# EasyEDA Pro project ProPrj_fidget keyboard_2026-06-28.epro

# Schematic Schematic1
Board Name: Board1; Create Date: 2026-06-21; Page Name: P1; Project Name: fidget keyboard; Schematic Name: Schematic1; Update Date: 2026-06-21; Company: EasyEDA.com; Page Size: A4; Version: V1.0
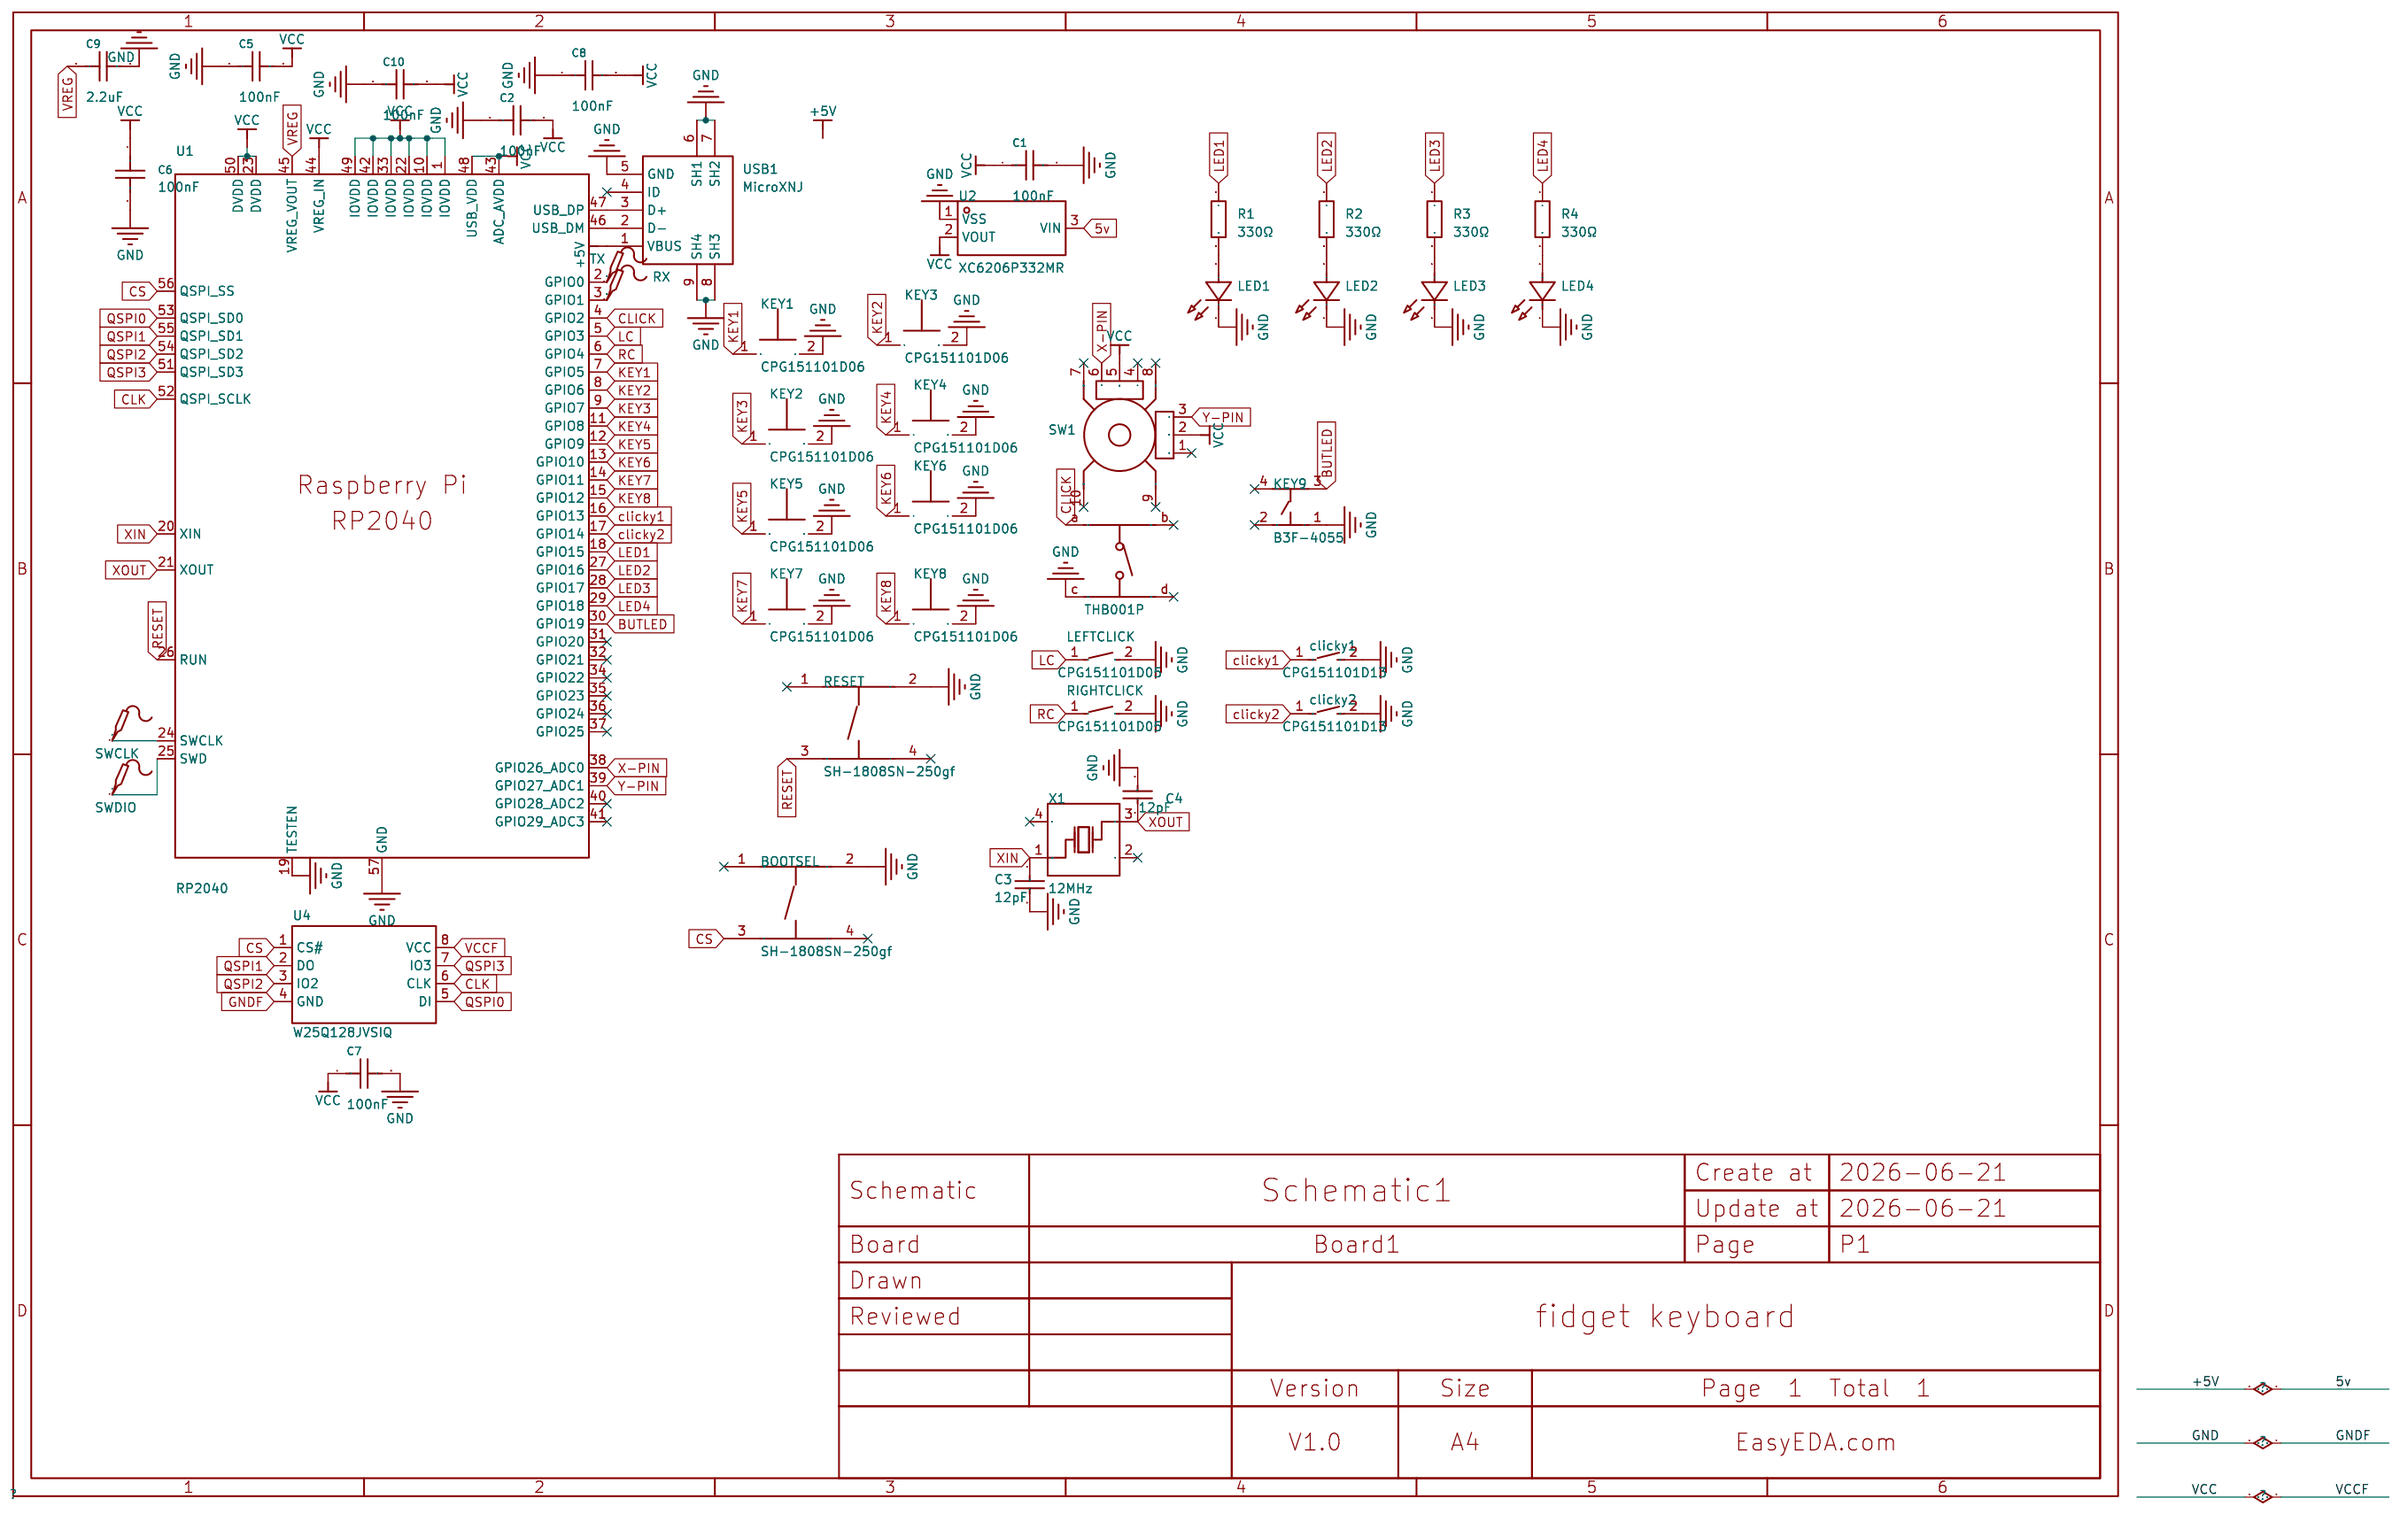
[diagram p0: schematic sheet]

## Parts
BOOTSEL  SH-1808SN-250gf  [SW-SMD_4P-L4.2-W3.4-P2.15-LS5.2]
C1  100nF  [C0402]
C2  100nF  [C0402]
C3  12pF  [C0603]
C4  12pF  [C0603]
C5  100nF  [C0402]
C6  100nF  [C0402]
C7  100nF  [C0402]
C8  100nF  [C0402]
C9  2.2uF  [C0603]
C10  100nF  [C0402]
clicky1  CPG151101D13  [KEY-TH_CPG151101D21X]
clicky2  CPG151101D13  [KEY-TH_CPG151101D21X]
KEY1  CPG151101D06  [KEY-TH_CPG151101D06]
KEY2  CPG151101D06  [KEY-TH_CPG151101D06]
KEY3  CPG151101D06  [KEY-TH_CPG151101D06]
KEY4  CPG151101D06  [KEY-TH_CPG151101D06]
KEY5  CPG151101D06  [KEY-TH_CPG151101D06]
KEY6  CPG151101D06  [KEY-TH_CPG151101D06]
KEY7  CPG151101D06  [KEY-TH_CPG151101D06]
KEY8  CPG151101D06  [KEY-TH_CPG151101D06]
KEY9  B3F-4055  [KEY-TH_4P-L12.0-W12.0-P5.00-LS13.4-EH]
LED1  XL-1608SURC-06  [LED0603-RD_RED]
LED2  XL-1608SURC-06  [LED0603-RD_RED]
LED3  XL-1608SURC-06  [LED0603-RD_RED]
LED4  XL-1608SURC-06  [LED0603-RD_RED]
LEFTCLICK  CPG151101D05  [SW-TH_CPG151101D05]
R1  330Ω  [R0603]
R2  330Ω  [R0603]
R3  330Ω  [R0603]
R4  330Ω  [R0603]
RESET  SH-1808SN-250gf  [SW-SMD_4P-L4.2-W3.4-P2.15-LS5.2]
RIGHTCLICK  CPG151101D05  [SW-TH_CPG151101D05]
RX  -  [Test-Point-0.5mm]
SW1  THB001P  [SW-TH_THB001P]
SWCLK  -  [Test-Point-0.5mm]
SWDIO  -  [Test-Point-0.5mm]
TX  -  [Test-Point-0.5mm]
U1  RP2040  [LQFN-56_L7.0-W7.0-P0.4-EP]
U2  XC6206P332MR  [SOT-23-3_L3.0-W1.7-P0.95-LS2.9-BR]
U4  W25Q128JVSIQ  [SOIC-8_L5.3-W5.3-P1.27-LS8.0-BL]
USB1  MicroXNJ  [MICRO-USB-SMD_MICROXNJ_1]
X1  12MHz  [OSC-SMD_4P-L3.2-W2.5-BL]

## Library data of the parts
BOOTSEL RESET = SH-1808SN-250gf: LCSC Part Name: TS3425PA 250gf编带; Supplier Part: C52092028; Manufacturer: SHOU HAN(首韩); Supplier Footprint: SMD; JLCPCB Part Class: Extended Part; Datasheet: https://item.szlcsc.com/datasheet/SH-1808SN-250gf/54864052.html; Supplier: LCSC
C1 C2 C5-C8 C10 = 0402B104K160CT_C83056: Capacitance: Tolerance:±10% Tolerance:±10% Voltage Rated: Temperature Coefficient:; LCSC Part Name: 100nF ±10% 16V; Supplier Part: C83056; Manufacturer: Walsin(华新科); Manufacturer Part: 0402B104K160CT; Supplier Footprint: 0402; JLCPCB Part Class: Extended Part; Datasheet: https://atta.szlcsc.com/upload/public/pdf/source/20161119/1479540178927.pdf; Supplier: LCSC; Tolerance: ±10%
C3 C4 = CC0603JRNPO9BN120: Capacitance:12pF Tolerance:±5% Tolerance:±5% Voltage Rating:50V Temperature Coefficient:NP0; LCSC Part Name: 12pF ±5% 50V; Supplier Part: C107034; Manufacturer: YAGEO(国巨); Supplier Footprint: 0603; JLCPCB Part Class: Extended Part; Datasheet: https://item.szlcsc.com/datasheet/CC0603JRNPO9BN120/108250.html; Supplier: LCSC; Tolerance: ±5%; Voltage Rating: 50V; Temperature Coefficient: NP0
C9 = GRM188R71A225KE15D: Capacitance: Tolerance:±10% Tolerance:±10% Voltage Rated: Temperature Coefficient:; LCSC Part Name: 2.2uF ±10% 10V; Supplier Part: C86018; Manufacturer: muRata(村田); Supplier Footprint: 0603; JLCPCB Part Class: Extended Part; Datasheet: https://atta.szlcsc.com/upload/public/pdf/source/20200305/C490387_23319AE8C154DEB24C505E6C82A8106A.pdf; Supplier: LCSC; Tolerance: ±10%
clicky1 clicky2 = CPG151101D13: Axis Type:Blue Switch Operation Force:50gf Conduction Travel:2.2mm Voltage Rating:12V Operating Temperature:-40℃~+70℃ Operating Temperature:-40℃~+70℃; LCSC Part Name: 青轴; Supplier Part: C49234235; Manufacturer: HanElectricity(瀚源); Supplier Footprint: 插件; JLCPCB Part Class: Extended Part; Datasheet: https://item.szlcsc.com/datasheet/CPG151101D13/51650377.html; Supplier: LCSC; Axis Type: Blue Switch; Operation Force: 50gf; Conduction Travel: 2.2mm; Voltage Rating: 12V; Operating Temperature: -40℃~+70℃
KEY1-KEY8 = CPG151101D06: Axis Type:Brown Switch Operation Force:45gf Conduction Travel:2mm Voltage Rating:12V Operating Temperature:-40℃~+70℃ Operating Temperature:-40℃~+70℃; LCSC Part Name: 茶轴; Supplier Part: C49234237; Manufacturer: HanElectricity(瀚源); Supplier Footprint: 插件; JLCPCB Part Class: Extended Part; Datasheet: https://item.szlcsc.com/datasheet/CPG151101D06/51650379.html; Supplier: LCSC; Axis Type: Brown Switch; Operation Force: 45gf; Conduction Travel: 2mm; Voltage Rating: 12V; Operating Temperature: -40℃~+70℃
KEY9 = B3F-4055_C84931: Circuit:SPST Actuator Style:Rectangular Button Mounting Type:Through Hole Length:12mm Width:12mm Switch Height:7.3mm Contact Current:50mA Voltage Rating:24V With Lamp:- Life:-; LCSC Part Name: 12*12*7.3mm 直插 轻触开关; Supplier Part: C84931; Manufacturer: OMRON(欧姆龙); Supplier Footprint: 插件-4P,12x12mm; JLCPCB Part Class: Extended Part; Datasheet: https://item.szlcsc.com/datasheet/B3F-4055/86103.html; Supplier: LCSC; Circuit: SPST; Actuator Style: Rectangular Button; Mounting Type: Through Hole; Length: 12mm; Width: 12mm; Switch Height: 7.3mm; Contact Current: 50mA; Voltage Rating: 24V
LED1-LED4 = XL-1608SURC-06: Lamp Holder Type:1.6mm x 0.8mm square LED Illumination Color:Red Voltage - Forward(Vf):2.3V Voltage - Forward(Vf):2.3V Power(Watts):50mW Forward Current:20mA Wavelength - Dominant:620nm~630nm Wavelength - Dominant:620nm~630nm Peak Wavelength:625nm Peak Wa; LCSC Part Name: 0603红色贴片式发光二极管; Supplier Part: C965799; Manufacturer: XINGLIGHT(成兴光); Supplier Footprint: 0603; JLCPCB Part Class: Extended Part; Datasheet: https://item.szlcsc.com/datasheet/XL-1608SURC-06/1051408.html; Supplier: LCSC; Lamp Holder Type: 1.6mm x 0.8mm square LED; Illumination Color: Red; Voltage - Forward(Vf): 2.3V; Power(Watts): 50mW; Forward Current: 20mA; Wavelength - Dominant: 620nm~630nm; Peak Wavelength: 625nm; Diode Configuration: Discrete Diode; Lens Color: Water Clear; Luminous Intensity: 225mcd; Viewing Angle: 120°; Mounting Style: Top-mount; Operating Temperature: -40℃~+85℃
LEFTCLICK RIGHTCLICK = CPG151101D05: Axis Type:Red Switch Operation Force:45gf Conduction Travel:2mm Voltage Rating:12V Operating Temperature:-40℃~+70℃ Operating Temperature:-40℃~+70℃; LCSC Part Name: 红轴; Supplier Part: C49234236; Manufacturer: HanElectricity(瀚源); Supplier Footprint: 插件; JLCPCB Part Class: Extended Part; Datasheet: https://item.szlcsc.com/datasheet/CPG151101D05/51650378.html; Supplier: LCSC; Axis Type: Red Switch; Operation Force: 45gf; Conduction Travel: 2mm; Voltage Rating: 12V; Operating Temperature: -40℃~+70℃
R1-R4 = RK73B1JTTD331J: Type:Thick Film Resistor Resistance:330Ω Tolerance:±5% Tolerance:±5% Power(Watts):125mW Voltage-Supply(Max):75V Temperature Coefficient:±200ppm/℃ Temperature Coefficient:±200ppm/℃ Operating Temperature:-55℃~+155℃ Operating Temperature:-55℃~+155℃; LCSC Part Name: 厚膜电阻 330Ω ±5% 125mW; Supplier Part: C131709; Manufacturer: KOA; Supplier Footprint: 0603; JLCPCB Part Class: Extended Part; Datasheet: https://item.szlcsc.com/datasheet/RK73B1JTTD331J/143005.html; Supplier: LCSC; Type: Thick Film Resistor; Tolerance: ±5%; Power(Watts): 125mW; Voltage-Supply(Max): 75V; Temperature Coefficient: ±200ppm/℃; Operating Temperature: -55℃~+155℃
RX SWCLK SWDIO TX = Test-Point: Test Point 测试点
SW1 = THB001P: Mounting Type:Straight Voltage Rating:12V Current Rating:50mA Mechanical Life:10,000 cycles Operating Temperature:-10℃~+70℃ Operating Temperature:-10℃~+70℃; LCSC Part Name: 微型指拨摇杆开关; Supplier Part: C2685355; Manufacturer: C&K; Supplier Footprint: 插件-14P,21x17mm; JLCPCB Part Class: Extended Part; Datasheet: https://item.szlcsc.com/datasheet/THB001P/2784876.html; Supplier: LCSC; Mounting Type: Straight; Voltage Rating: 12V; Current Rating: 50mA; Mechanical Life: 10,000 cycles; Operating Temperature: -10℃~+70℃
U1 = RP2040_C2040: CPU Core:- CPU Maximum Speed:133MHz Number of I/O:30 ADC (Bit):12bit; LCSC Part Name: RP2040（RP2B2）; Supplier Part: C2040; Manufacturer: Raspberry Pi(树莓派); Supplier Footprint: LQFN-56(7x7); JLCPCB Part Class: Extended Part; Datasheet: https://item.szlcsc.com/datasheet/RP2040/2392.html; Supplier: LCSC; CPU Maximum Speed: 133MHz; Number of I/O: 30; ADC (Bit): 12bit
U2 = XC6206P332MR_C347376: Output Configuration:Positive Voltage - Supply:8V Output Voltage:3.3V Output Voltage:3.3V Output Current:250mA Power Supply Rejection Ratio (PSRR):40dB@(1kHz) Voltage Dropout:240mV@(50mA) standby current:7uA Noise:- Features:Over Current Protection；Short; LCSC Part Name: 3.3V 250mA 8V; Supplier Part: C347376; Manufacturer: UMW(友台半导体); Supplier Footprint: SOT-23; JLCPCB Part Class: Extended Part; Datasheet: https://item.szlcsc.com/datasheet/XC6206P332MR/324036.html; Supplier: LCSC; Output Configuration: Positive; Voltage - Supply: 8V; Output Voltage: 3.3V; Output Current: 250mA; Power Supply Rejection Ratio (PSRR): 40dB@(1kHz); Voltage Dropout: 240mV@(50mA); standby current: 7uA; Features: Over Current Protection；Short Circuit Protection; Operating Temperature: -25℃~+80℃@(Ta); Output Type: Fixed; Number of Outputs: 1
U4 = W25Q128JVSIQ: Interface:SPI Memory Size:128Mbit Clock Frequency:133MHz Voltage - Supply:2.7V~3.6V Voltage - Supply:2.7V~3.6V Standby Supply Current:1uA Program / Erase Cycles:100,000 Cycles Page Programming Time (Tpp):3ms Block Erase Time(tBE):120ms@(32KB) Data Retenti; LCSC Part Name: 编带 支持双路/四路SPI接口的3V、128Mbit 串行闪存; Supplier Part: C97521; Manufacturer: Winbond(华邦); Supplier Footprint: SOIC-8-208mil; JLCPCB Part Class: Basic Part; Datasheet: https://item.szlcsc.com/datasheet/W25Q128JVSIQ/98729.html; Supplier: LCSC; Interface: SPI; Memory Size: 128Mbit; Clock Frequency: 133MHz; Voltage - Supply: 2.7V~3.6V; Standby Supply Current: 1uA; Program / Erase Cycles: 100,000 Cycles; Page Programming Time (Tpp): 3ms; Block Erase Time(tBE): 120ms@(32KB); Data Retention - TDR (Year): 20 Years; Operating Temperature: -40℃~+85℃
USB1 = MicroXNJ: Connector Type:Micro-B Protocol Standard:USB 2.0 Gender:Female Mounting Type:Surface Mount, Right Angle Number of Contacts:5P Number of Ports:1 Current Rating-Power:1.8A Voltage Rating:30V Connect-Disconnect Life:5,000 times Detection color:Black Operatin; LCSC Part Name: Micro小牛角卧贴母座; Supplier Part: C404969; Manufacturer: SHOU HAN(首韩); Supplier Footprint: SMD; JLCPCB Part Class: Extended Part; Datasheet: https://item.szlcsc.com/datasheet/MicroXNJ/392534.html; Supplier: LCSC; Connector Type: Micro-B; Protocol Standard: USB 2.0; Gender: Female; Mounting Type: Surface Mount, Right Angle; Number of Contacts: 5P; Number of Ports: 1; Current Rating-Power: 1.8A; Voltage Rating: 30V; Connect-Disconnect Life: 5,000 times; Detection color: Black; Operating Temperature: -20℃~+85℃
X1 = TXM12M0004322CBCDO00T: Type:Crystal Oscillator Frequency:12MHz Normal temperature Frequency Tolerance:±10ppm Normal temperature Frequency Tolerance:±10ppm Load Capacitance:9pF Frequency Stability:±20ppm Frequency Stability:±20ppm Equivalent Series Resistance(ESR):60Ω Operating; LCSC Part Name: 12MHz ±10ppm 9pF; Supplier Part: C362368; Manufacturer: YJX(雅晶鑫); Supplier Footprint: SMD3225-4P; JLCPCB Part Class: Extended Part; Datasheet: https://item.szlcsc.com/datasheet/TXM12M0004322CBCDO00T/337108.html; Supplier: LCSC; Type: Crystal Oscillator; Normal temperature Frequency Tolerance: ±10ppm; Load Capacitance: 9pF; Frequency Stability: ±20ppm; Equivalent Series Resistance(ESR): 60Ω; Operating Temperature: -40℃~+85℃

## Nets
+5V: U2.3(VIN) USB1.1(VBUS)
GND: BOOTSEL.2 C1.2 C2.1 C3.2 C4.2 C5.1 C6.2 C7.2 C8.1 C9.2 C10.1 clicky1.2 clicky2.2 KEY1.2 KEY2.2 KEY3.2 KEY4.2 KEY5.2 KEY6.2 KEY7.2 KEY8.2 KEY9.1 LED1.1(K) LED2.1(K) LED3.1(K) LED4.1(K) LEFTCLICK.2 RESET.2 RIGHTCLICK.2 SW1.c U1.19(TESTEN) U1.57(GND) U2.1(VSS) U4.4(GND) USB1.5(GND) USB1.6(SH1) USB1.7(SH2) USB1.8(SH3) USB1.9(SH4)
VCC: C1.1 C2.2 C5.2 C6.1 C7.1 C8.2 C10.2 SW1.2(DTA) SW1.5(DTA) U1.1(IOVDD) U1.10(IOVDD) U1.22(IOVDD) U1.23(DVDD) U1.33(IOVDD) U1.42(IOVDD) U1.43(ADC_AVDD) U1.44(VREG_IN) U1.48(USB_VDD) U1.49(IOVDD) U1.50(DVDD) U2.2(VOUT) U4.8(VCC)
BUTLED: KEY9.3 U1.30(GPIO19)
CLICK: SW1.a U1.4(GPIO2)
clicky1: clicky1.1 U1.16(GPIO13)
clicky2: clicky2.1 U1.17(GPIO14)
CLK: U1.52(QSPI_SCLK) U4.6(CLK)
CS: BOOTSEL.3 U1.56(QSPI_SS) U4.1(CS#)
KEY1: KEY1.1 U1.7(GPIO5)
KEY2: KEY3.1 U1.8(GPIO6)
KEY3: KEY2.1 U1.9(GPIO7)
KEY4: KEY4.1 U1.11(GPIO8)
KEY5: KEY5.1 U1.12(GPIO9)
KEY6: KEY6.1 U1.13(GPIO10)
KEY7: KEY7.1 U1.14(GPIO11)
KEY8: KEY8.1 U1.15(GPIO12)
LC: LEFTCLICK.1 U1.5(GPIO3)
LED1: R1.1 U1.18(GPIO15)
LED2: R2.1 U1.27(GPIO16)
LED3: R3.1 U1.28(GPIO17)
LED4: R4.1 U1.29(GPIO18)
QSPI0: U1.53(QSPI_SD0) U4.5(DI)
QSPI1: U1.55(QSPI_SD1) U4.2(DO)
QSPI2: U1.54(QSPI_SD2) U4.3(IO2)
QSPI3: U1.51(QSPI_SD3) U4.7(IO3)
RC: RIGHTCLICK.1 U1.6(GPIO4)
RESET: RESET.3 U1.26(RUN)
VREG: C9.1 U1.45(VREG_VOUT)
X-PIN: SW1.6(B) U1.38(GPIO26_ADC0)
XIN: C3.1 U1.20(XIN) X1.1(OSC1)
XOUT: C4.1 U1.21(XOUT) X1.3(OSC2)
Y-PIN: SW1.3(A) U1.39(GPIO27_ADC1)
$1N5: U1.47(USB_DP) USB1.3(D+)
$1N6: U1.46(USB_DM) USB1.2(D-)
$1N65: SWCLK.1 U1.24(SWCLK)
$1N66: SWDIO.1 U1.25(SWD)
$1N128: TX.1 U1.2(GPIO0)
$1N129: RX.1 U1.3(GPIO1)
$1N131: LED1.2(A) R1.2
$1N132: LED2.2(A) R2.2
$1N134: LED3.2(A) R3.2
$1N136: LED4.2(A) R4.2

Not connected (* = marked no-connect by the designer): BOOTSEL 1* 4*; KEY9 2* 4*; RESET 1* 4*; SW1 1(B)* 4(A)* 7(GND)* 8(GND)* 9(GND)* 10(GND)* b* d*; U1 31(GPIO20)* 32(GPIO21)* 34(GPIO22)* 35(GPIO23)* 36(GPIO24)* 37(GPIO25)* 40(GPIO28_ADC2)* 41(GPIO29_ADC3)*; USB1 4(ID)*; X1 2* 4*

# Board PCB1
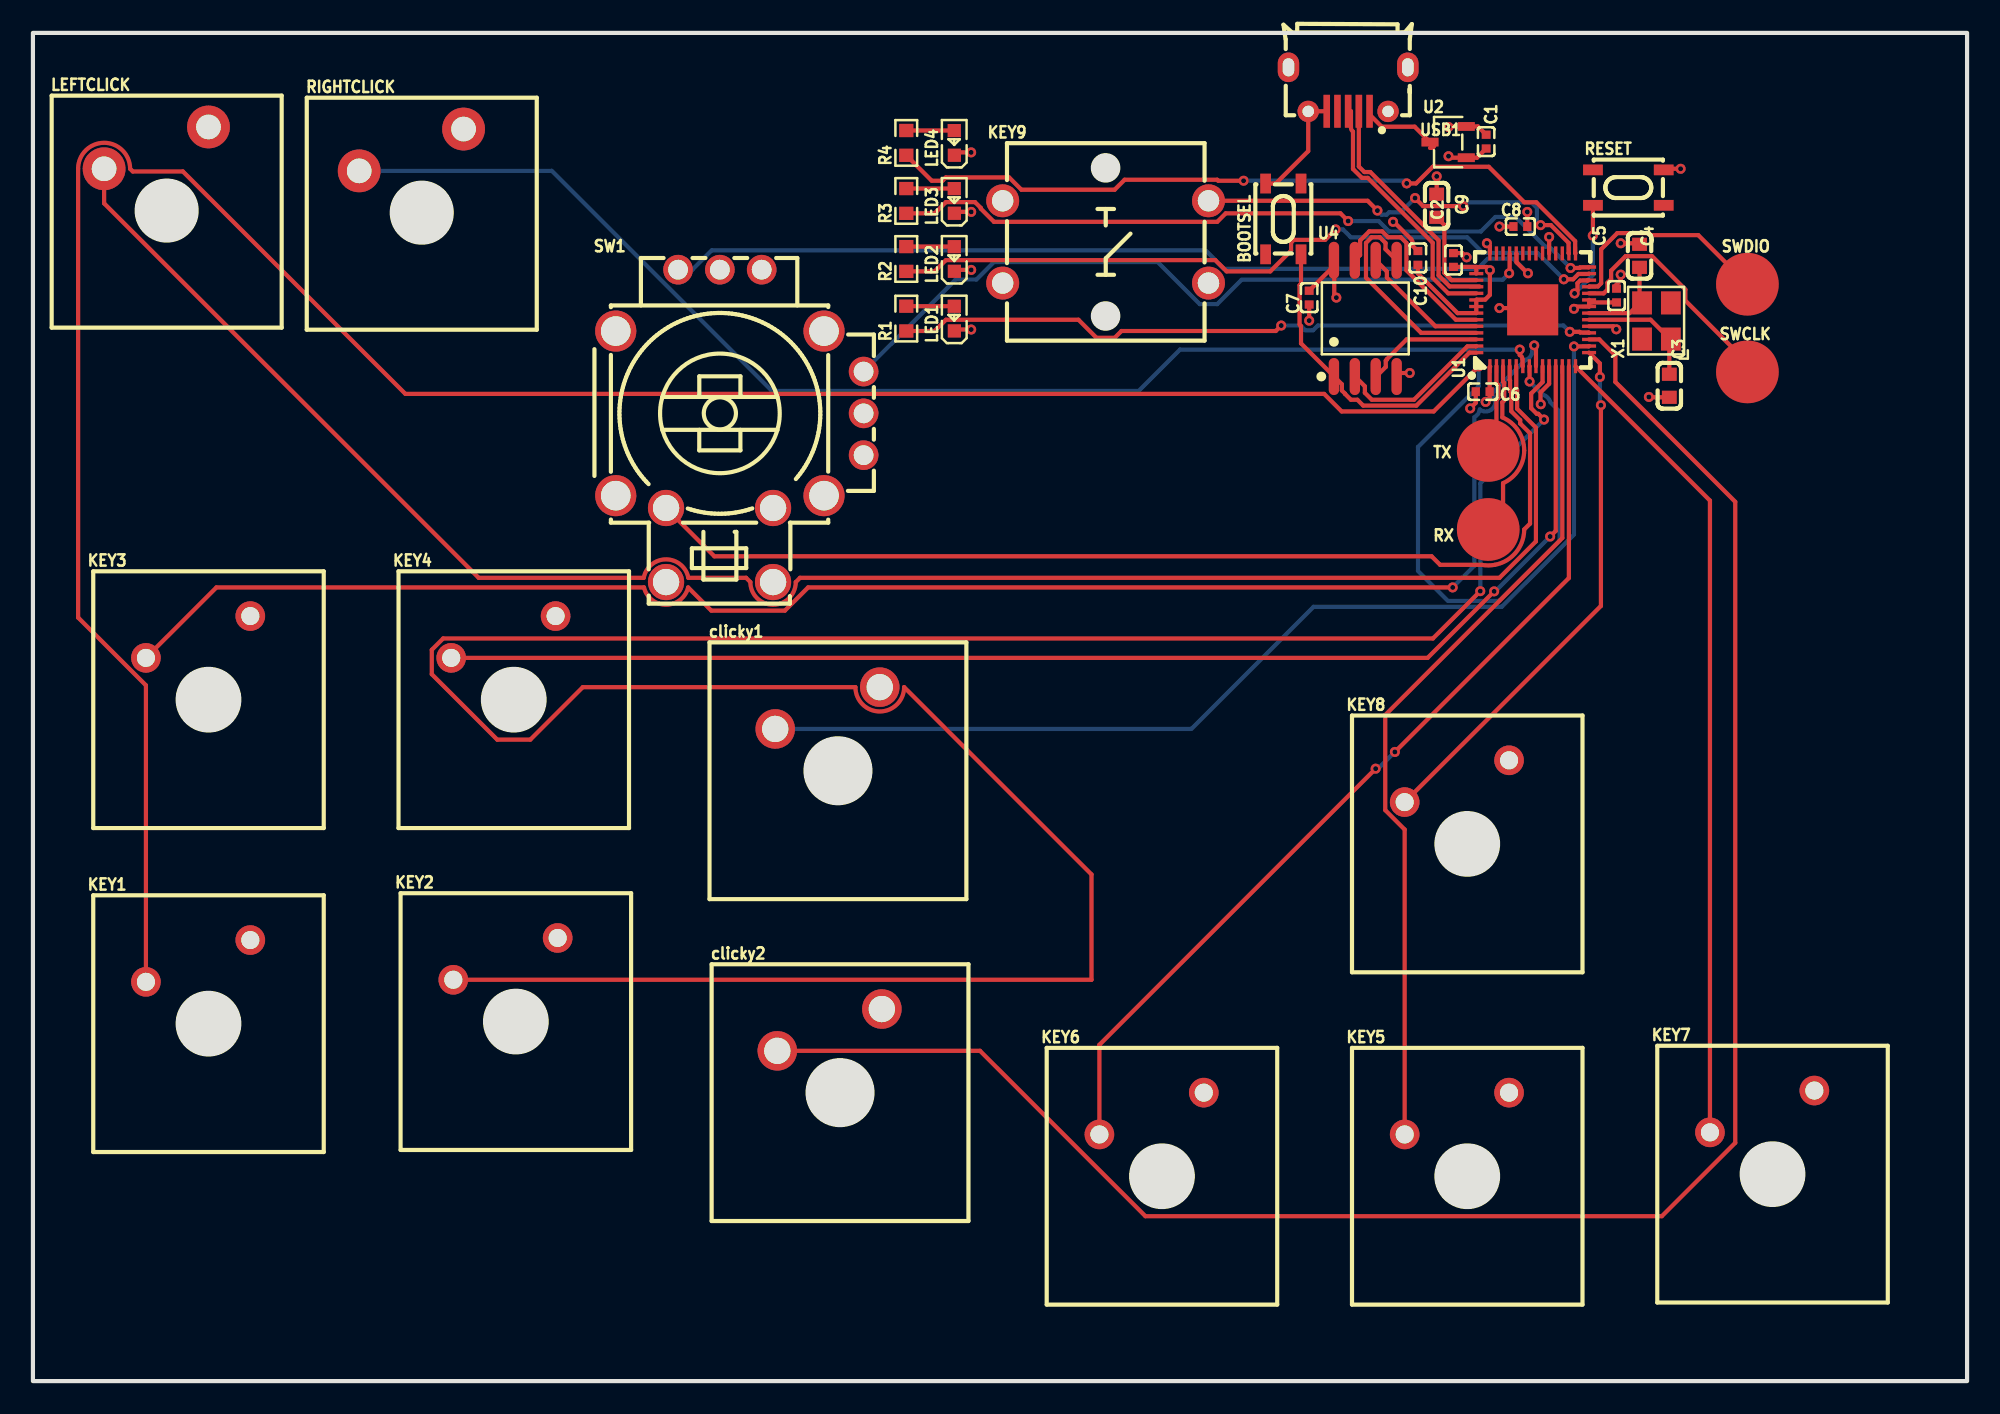
[diagram p1: board, top side]
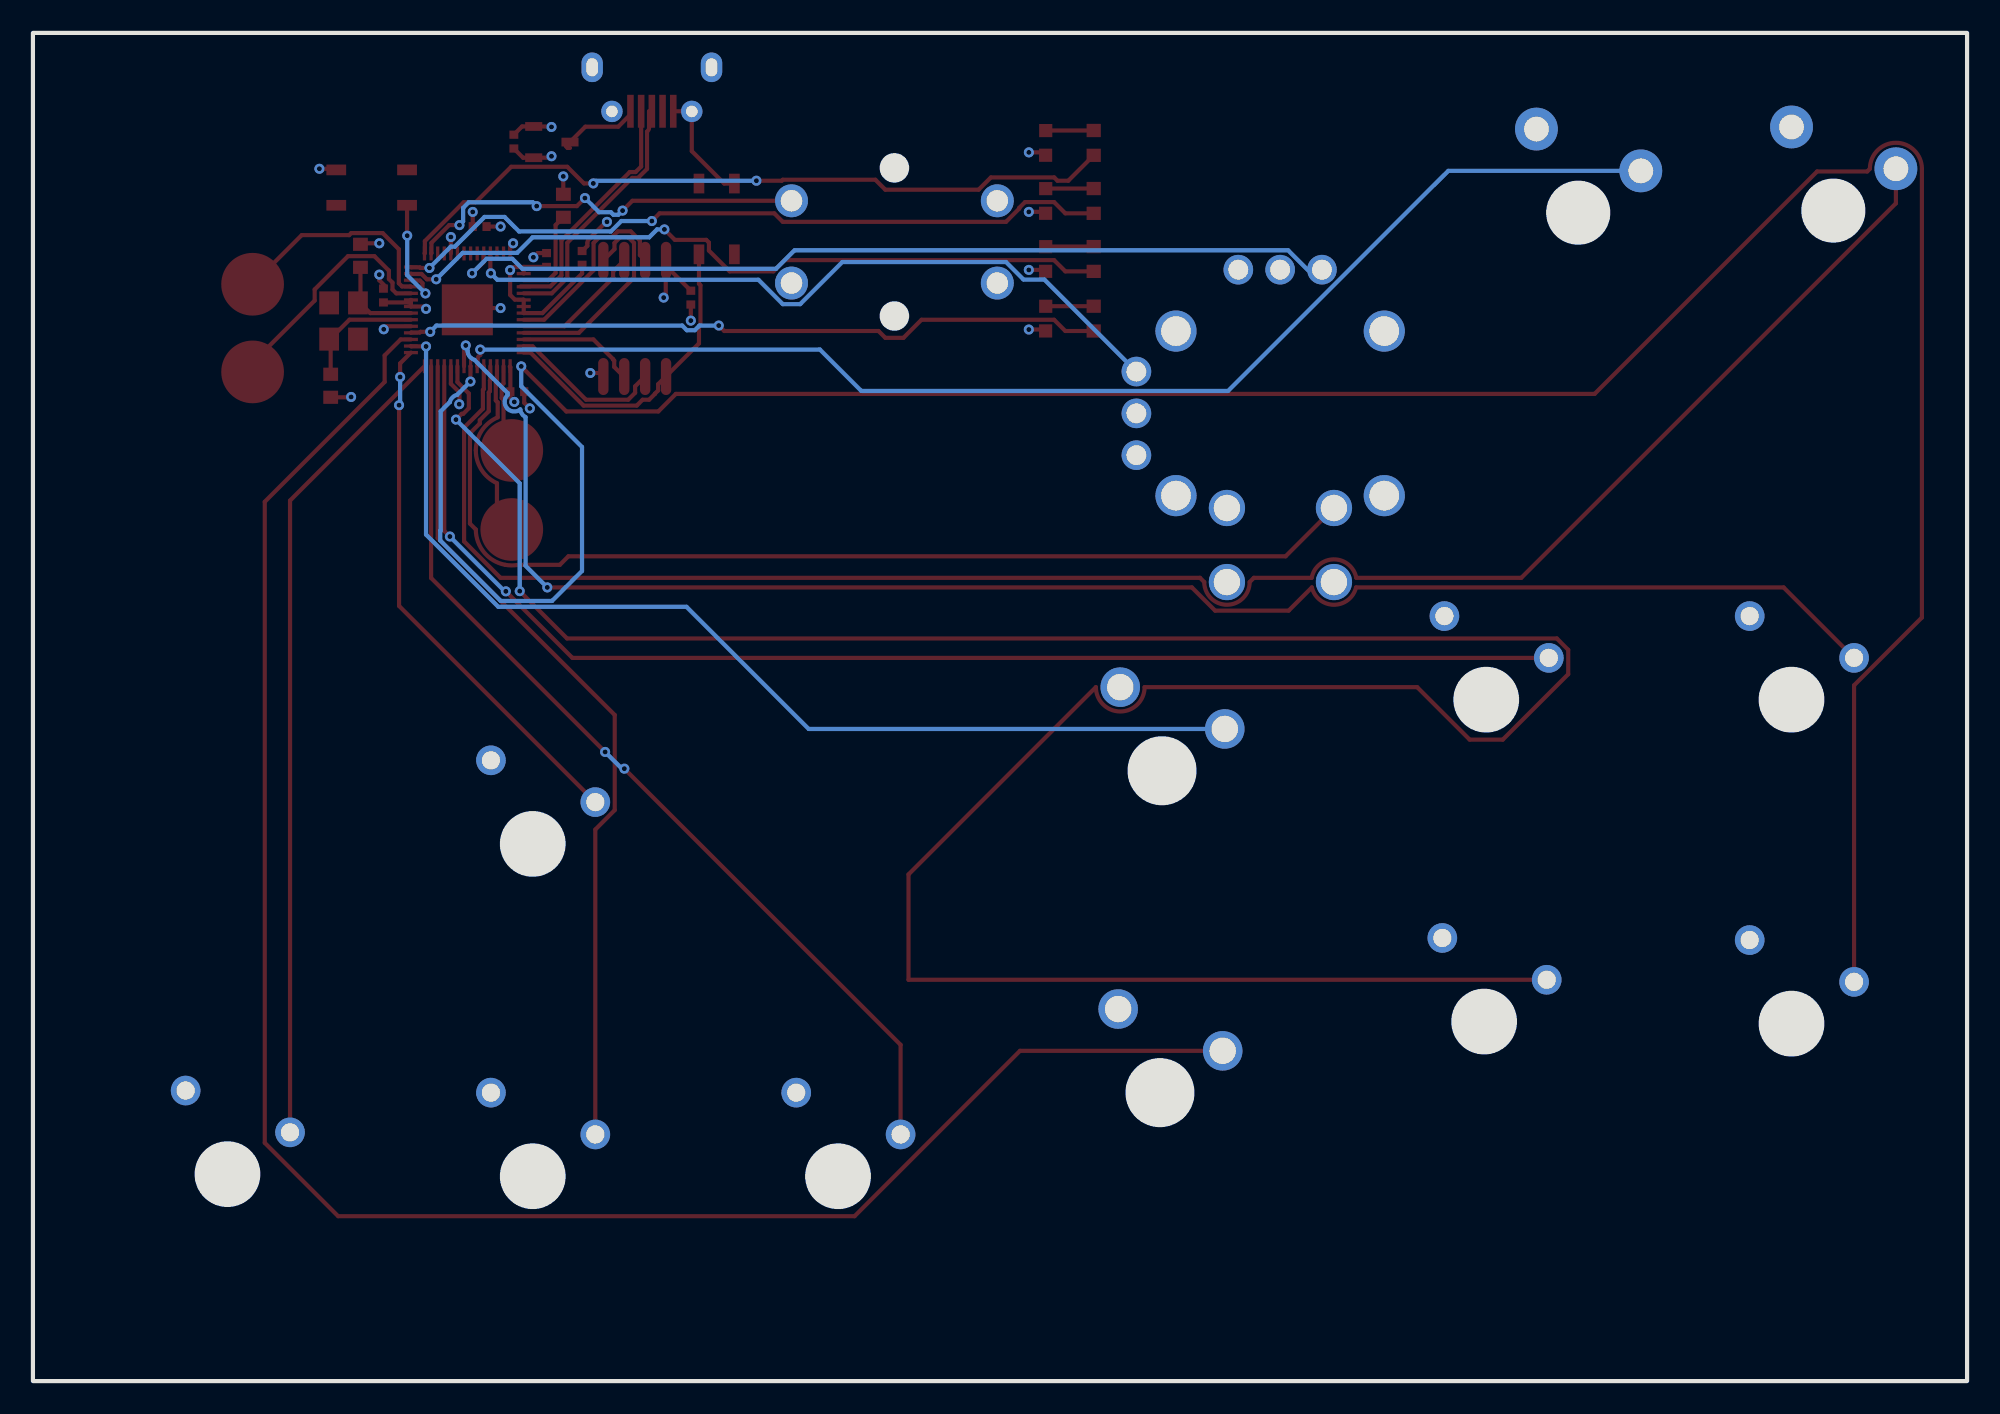
[diagram p2: board, bottom side, seen from below]

Outline 117.47 x 81.91 mm; copper layers: Top Layer, VCC, GND, Bottom Layer. Coordinates in mm from the lower left corner of the outline.
Outline path: rectangle 0,81.91 117.47,0
Stack: Top Layer 0.035mm / Dielectric1 1.51mm FR4 er 4.5 / VCC 0.035mm / GND 0.035mm / Bottom Layer 0.035mm

## Design rules (mm)
spacing copperThickness1oz (default): track to track 0.102, other pairs 0.152 to 0.3
spacing copperThickness2oz: track to track 0.203, other pairs 0.152 to 0.3
track width copperThickness1oz (default): min 0.127, default 0.254, max 2.54
track width copperThickness2oz: min 0.203, default 0.254, max 2.54
differential pair differentialPair (default): width min 0.127, default 0.254, max 2.54; gap min 0.152, default 0.152

## Placement (name value [footprint] x y rotation side)
BOOTSEL  SH-1808SN-250gf  [SW-SMD_4P-L4.2-W3.4-P2.15-LS5.2]  75.95 70.61 90 top
C1  100nF  [C0402]  88.26 75.31 270 top
C2  100nF  [C0402]  86.28 68.12 270 top
C3  12pF  [C0603]  99.39 60.48 270 top
C4  12pF  [C0603]  97.58 68.37 90 top
C5  100nF  [C0402]  96.18 65.96 270 top
C6  100nF  [C0402]  88.06 60.12 180 top
C7  100nF  [C0402]  77.52 65.83 270 top
C8  100nF  [C0402]  90.34 70.15 0 top
C9  2.2uF  [C0603]  85.26 71.41 90 top
C10  100nF  [C0402]  84.12 68.24 270 top
clicky1  CPG151101D13  [KEY-TH_CPG151101D21X]  48.26 40.89 0 top
clicky2  CPG151101D13  [KEY-TH_CPG151101D21X]  48.39 21.34 0 top
KEY1  CPG151101D06  [KEY-TH_CPG151101D06]  10.03 25.53 0 top
KEY2  CPG151101D06  [KEY-TH_CPG151101D06]  28.7 25.65 0 top
KEY3  CPG151101D06  [KEY-TH_CPG151101D06]  10.03 45.21 0 top
KEY4  CPG151101D06  [KEY-TH_CPG151101D06]  28.58 45.21 0 top
KEY5  CPG151101D06  [KEY-TH_CPG151101D06]  86.49 16.26 0 top
KEY6  CPG151101D06  [KEY-TH_CPG151101D06]  67.94 16.26 0 top
KEY7  CPG151101D06  [KEY-TH_CPG151101D06]  105.03 16.38 0 top
KEY8  CPG151101D06  [KEY-TH_CPG151101D06]  86.49 36.45 0 top
KEY9  B3F-4055  [KEY-TH_4P-L12.0-W12.0-P5.00-LS13.4-EH]  65.15 69.21 0 top
LED1  XL-1608SURC-06  [LED0603-RD_RED]  55.96 64.56 90 top
LED2  XL-1608SURC-06  [LED0603-RD_RED]  55.96 68.18 90 top
LED3  XL-1608SURC-06  [LED0603-RD_RED]  55.96 71.71 90 top
LED4  XL-1608SURC-06  [LED0603-RD_RED]  55.96 75.23 90 top
LEFTCLICK  CPG151101D05  [SW-TH_CPG151101D05]  7.49 74.93 0 top
R1  330Ω  [R0603]  53.05 64.56 90 top
R2  330Ω  [R0603]  53.05 68.18 90 top
R3  330Ω  [R0603]  53.05 71.71 90 top
R4  330Ω  [R0603]  53.05 75.23 90 top
RESET  SH-1808SN-250gf  [SW-SMD_4P-L4.2-W3.4-P2.15-LS5.2]  96.9 72.52 0 top
RIGHTCLICK  CPG151101D05  [SW-TH_CPG151101D05]  22.99 74.8 0 top
RX  -  [Test-Point-0.5mm]  88.39 51.74 0 top
SW1  THB001P  [SW-TH_THB001P]  42.93 58.04 0 top
SWCLK  -  [Test-Point-0.5mm]  104.13 61.32 0 top
SWDIO  -  [Test-Point-0.5mm]  104.13 66.64 0 top
TX  -  [Test-Point-0.5mm]  88.39 56.55 0 top
U1  RP2040  [LQFN-56_L7.0-W7.0-P0.4-EP]  91.09 65.09 90 top
U2  XC6206P332MR  [SOT-23-3_L3.0-W1.7-P0.95-LS2.9-BR]  85.96 75.28 0 top
U4  W25Q128JVSIQ  [SOIC-8_L5.3-W5.3-P1.27-LS8.0-BL]  80.92 64.57 0 top
USB1  MicroXNJ  [MICRO-USB-SMD_MICROXNJ_1]  79.88 78.49 180 top
X1  12MHz  [OSC-SMD_4P-L3.2-W2.5-BL]  98.61 64.41 90 top

## Footprints (pads in the part's own frame, mm; a bottom-side part is the same pattern mirrored in y, then rotated)
C0402
  rect 0.5x0.54 smd: 1(-0.42,0) 2(0.42,0)
C0603
  rect 0.8x0.9 smd: 1(-0.7,0) 2(0.7,0)
KEY-TH_4P-L12.0-W12.0-P5.00-LS13.4-EH
  round 2 hole 1.3: 1(6.25,-2.5) 2(-6.25,-2.5) 3(6.25,2.5) 4(-6.25,2.5)
KEY-TH_CPG151101D06
  round 1.8 hole 1.1: 1(-3.17,-1.27) 2(3.17,1.27)
KEY-TH_CPG151101D21X
  round 2.4 hole 1.6: 1(-3.175,-1.27) 2(3.175,1.27)
LED0603-RD_RED
  rect 0.8x0.8 smd: 1(-0.749,-0.004) 2(0.749,0.004)
LQFN-56_L7.0-W7.0-P0.4-EP
  rect 0.85x0.2 smd: 1(-3.425,2.6) 2(-3.425,2.2) 3(-3.425,1.8) 4(-3.425,1.4) 5(-3.425,1) 6(-3.425,0.6) 7(-3.425,0.2) 8(-3.425,-0.2) 9(-3.425,-0.6) 10(-3.425,-1) 11(-3.425,-1.4) 12(-3.425,-1.8) 13(-3.425,-2.2) 14(-3.425,-2.6) 29(3.425,-2.6) 30(3.425,-2.2) 31(3.425,-1.8) 32(3.425,-1.4) 33(3.425,-1) 34(3.425,-0.6) 35(3.425,-0.2) 36(3.425,0.2) 37(3.425,0.6) 38(3.425,1) 39(3.425,1.4) 40(3.425,1.8) 41(3.425,2.2) 42(3.425,2.6)
  rect 0.2x0.85 smd: 15(-2.6,-3.425) 16(-2.2,-3.425) 17(-1.8,-3.425) 18(-1.4,-3.425) 19(-1,-3.425) 20(-0.6,-3.425) 21(-0.2,-3.425) 22(0.2,-3.425) 23(0.6,-3.425) 24(1,-3.425) 25(1.4,-3.425) 26(1.8,-3.425) 27(2.2,-3.425) 28(2.6,-3.425) 43(2.6,3.425) 44(2.2,3.425) 45(1.8,3.425) 46(1.4,3.425) 47(1,3.425) 48(0.6,3.425) 49(0.2,3.425) 50(-0.2,3.425) 51(-0.6,3.425) 52(-1,3.425) 53(-1.4,3.425) 54(-1.8,3.425) 55(-2.2,3.425) 56(-2.6,3.425)
  rect 3.1x3.1 smd: 57(0,0)
MICRO-USB-SMD_MICROXNJ_1
  rect 0.4x2 smd: 1(-1.3,1.332) 2(-0.65,1.332) 3(0,1.332) 4(0.65,1.332) 5(1.3,1.332)
  round 1.3 hole 0.7: 6(2.425,1.34) 9(-2.425,1.34)
  oval 1.3x1.8 hole 0.7x1.1: 7(3.625,-1.34) 8(-3.625,-1.34)
OSC-SMD_4P-L3.2-W2.5-BL
  rect 1.4x1.2 smd: 1(-1.1,-0.875) 2(1.1,-0.875) 3(1.1,0.875) 4(-1.1,0.875)
R0603
  rect 0.806x0.864 smd: 1(-0.753,0) 2(0.753,0)
SOIC-8_L5.3-W5.3-P1.27-LS8.0-BL
  oval 0.63x2.25 smd: 1(-1.905,-3.53) 2(-0.635,-3.53) 3(0.635,-3.53) 4(1.905,-3.53) 5(1.905,3.53) 6(0.635,3.53) 7(-0.635,3.53) 8(-1.905,3.53)
SOT-23-3_L3.0-W1.7-P0.95-LS2.9-BR
  rect 1.038x0.532 smd: 1(1.101,-0.95) 2(1.101,0.95) 3(-1.101,0)
SW-SMD_4P-L4.2-W3.4-P2.15-LS5.2
  rect 1.2x0.65 smd: 1(-2.15,1.075) 2(2.15,1.075) 3(-2.15,-1.075) 4(2.15,-1.075)
SW-TH_CPG151101D05
  round 2.6 hole 1.5: 1(-3.17,-1.27) 2(3.17,1.27)
SW-TH_THB001P
  round 1.8 hole 1.2: 1(7.527,-1.78) 2(7.527,0.76) 3(7.527,3.3) 4(1.337,9.49) 5(-1.202,9.49) 6(-3.743,9.49)
  round 2.5 hole 1.8: 7(-7.527,5.76) 8(-7.527,-4.24) 9(5.122,-4.24) 10(5.122,5.76)
  round 2.2 hole 1.6: a(-4.472,-4.99) b(2.028,-4.99) c(-4.472,-9.49) d(2.028,-9.49)
Test-Point-0.5mm
  round 3.81 smd: 1(0,0)

## Nets
As in the schematic.

Pads without a net: BOOTSEL 1 4; KEY9 2 4; RESET 1 4; SW1 1 4 7 8 9 10 b d; U1 31 32 34 35 36 37 40 41; USB1 4; X1 2 4

## Via types
v1: diameter 0.61, hole 0.305, Top Layer to Bottom Layer, 57 vias

## Routing (per net, layer and track width the routed paths; a pad name or vN(x,y) marks a point on that pad's centre or on a via; arc(x,y) is an arc through that point)
+5V: length 4.9
  Top Layer w0.254: USB1.1 81.18,76.96 81.92,76.22 83.92,76.22 U2.3 ; 85.11,75.03 85,74.93 84.86,74.93
GND: length 28.8
  Top Layer w0.254: C1.2 87.71,74.33 86.05,74.33 85.96,74.42 ; C3.2 98.17,59.78 v1(98.15,59.8) ; 56.25,71.04 56.98,71.04 v1(56.99,71.04) ; v1(87.29,59.1) 87.64,59.44 C6.2 ; v1(87.08,68.28) 86.82,68.54 C2.1 ; v1(89.07,70.15) C8.1 ; v1(96.44,67.23) 96.44,66.89 96.06,66.51 ; 56.25,74.66 56.98,74.66 v1(56.98,74.66) ; BOOTSEL.2 75.49,72.76 77.46,74.73 USB1.6 77.47,77.15 USB1.5 ; v1(83.62,61.25) 83.07,61.25 82.85,61.03 ; v1(100.08,73.66) 99.12,73.66 RESET.2 ; U1.57 90.99,65.2 v1(89.07,65.2) ; v1(96.44,69.13) 97.52,69.13 C4.2 ; v1(96.17,63.91) 95.99,64.09 U1.19 ; 85.26,72.19 85.26,72.19 v1(85.26,73.2) ; C7.2 v1(77.52,64.43) ; v1(56.99,63.89) 56.98,63.89 56.25,63.89 ; v1(56.99,67.51) 56.98,67.52 56.25,67.52 ; v1(82.61,70.44) 82.66,70.44 83.69,69.4 arc(83.77,69.28) 83.8,69.15 83.8,68.97 84.12,68.66
  vias: v1(85.98,74.42)
VCC: length 28.5
  Top Layer w0.254: C2.2 87.66,67.7 U1.43 ; 84.12,67.82 84.12,67.3 86.53,64.89 U1.50 U1.49 U1.48 87.69,65.71 88.21,65.71 88.49,66 v1(88.49,67.5) 88.3,67.69 U1.43 ; U1.43 U1.44 ; U1.33 v1(92.09,69.51) ; 79.04,67.78 C7.1 ; 79.04,67.78 79.04,65.96 v1(79.17,65.83) ; 79.04,67.78 79.04,68.09 ; v1(93.6,65.15) 93.74,65.29 U1.22 U1.23 94.67,65.54 C5.2 ; 88.51,61.64 88.48,61.6 C6.1 88.48,59.74 v1(88.24,59.5) ; v1(88.31,69.13) 88.49,68.95 U1.42 ; U1.10 92.09,60.59 91.57,60.07 91.57,59.37 v1(91.58,59.35) ; C1.1 87.76,76.23 U2.2 87.06,76.23 85.95,76.23 ; C8.2 v1(90.76,71.04)
  vias: v1(85.98,76.2)
BUTLED: length 25.1
  Top Layer w0.254: v1(83.95,71.88) 84.44,71.39 v1(86.88,71.39) ; U1.30 93.27,68.54 93.27,69.16 92.19,70.24 v1(91.57,70.24) ; KEY9.3 81.07,71.71 v1(81.66,71.12)
  Bottom Layer w0.254: 86.87,71.37 87.12,71.62 91,71.62 91.35,71.28 91.35,70.46 v1(91.57,70.24) ; v1(81.66,71.12) 81.91,70.87 82.22,70.87 82.37,71.02 83.08,71.02 v1(83.95,71.88)
CLICK: length 65.4
  Top Layer w0.254: SW1.a 41.39,50.11 84.95,50.11 85.47,49.6 87.99,49.6 arc(88.39,49.56) 88.79,49.6 arc(90.07,50.35) 90.58,51.74 90.93,52.1 90.93,57.59 90.33,58.18 90.33,58.38 89.79,58.93 89.79,60.07 89.72,60.14 89.72,60.8 89.69,60.82 U1.4
CLICKY1:
  vias: v1(93.6,62.86)
clicky1: length 65.8
  Top Layer w0.254: U1.16 94.5,62.87 93.6,62.87 93.6,62.86
  Bottom Layer w0.254: clicky1.1 70.36,39.62 77.78,47.04 89.21,47.04 93.6,51.43 93.6,62.86
CLICKY2: length 116.5
  Top Layer w0.254: 94.52,63.29 95.14,63.29 96.11,62.32 96.11,60.71 103.39,53.43 103.39,14.48 98.94,10.02 67.57,10.02 57.52,20.07 45.72,20.07
CLK: length 8
  Top Layer w0.254: U4.6 82.24,67.42 82.24,67.04 85.19,64.09 U1.52
CS: length 19.3
  Top Layer w0.254: U1.56 87.25,62.49 84.03,59.27 80.8,59.27 80.44,59.63 80.05,59.63 79.7,59.98 79.7,59.99 79.5,60.19 79.5,60.57 77.02,63.05 77.02,64.1 76.93,64.19 76.93,66.58 77.02,66.67 BOOTSEL.3
KEY1: length 181.5
  Top Layer w0.254: v1(90.9,60.73) 90.9,61.66 U1.7 ; v1(87.82,61.65) 85.08,58.91 79.49,58.91 78.43,59.98 22.62,59.98 9.11,73.5 6.06,73.5 5.9,73.66 arc(4.32,75.24) 2.74,73.66 2.74,46.39 6.86,42.27 KEY1.1
  Bottom Layer w0.254: v1(90.9,60.73) 91.71,59.92 arc(92,59.77) 92.15,59.48 92.71,58.93 92.71,51.69 92.73,51.66 92.73,51.07 89.06,47.4 85.95,47.4 84.12,49.22 84.12,56.76 87.82,60.45 v1(87.82,61.65)
KEY2: length 101.9
  Top Layer w0.254: KEY3.1 11.14,48.22 37.11,48.22 arc(38.45,47.17) 39.79,48.22 41.2,46.81 45.67,46.81 47.08,48.22 v1(86.23,48.22) ; v1(91.18,62.93) 91.29,62.82 U1.8
  Bottom Layer w0.254: 87.55,58.53 87.55,49.54 v1(86.23,48.22) ; v1(91.18,62.93) 91.07,62.82 91.07,62.6 arc(91.07,62.52) 91.05,62.44 arc(90.9,62.2) 90.66,62.05 88.64,60.04 88.64,59.91 arc(88.68,59.11) 87.88,59.04 arc(87.77,58.77) 87.55,58.58
KEY3: length 177.2
  Top Layer w0.254: v1(87.91,48) 85.03,45.12 24.92,45.12 24.23,44.43 24.23,42.95 28.2,38.97 30.21,38.97 33.4,42.16 49.96,42.16 arc(51.44,40.68) 52.91,42.16 64.29,30.78 64.29,24.38 25.53,24.38 ; U1.9 91.69,60.7 91,60.01 91,59.11 91.34,58.77 91.43,58.77 v1(91.78,58.42)
  Bottom Layer w0.254: v1(91.78,58.42) 87.91,54.55 v1(87.91,48)
KEY4: length 80.3
  Top Layer w0.254: v1(92.15,51.32) 92.49,51.66 U1.11 ; KEY4.1 84.71,43.94 v1(88.75,47.98)
  Bottom Layer w0.254: v1(88.75,47.98) 88.82,47.98 v1(92.15,51.32)
KEY5: length 51.6
  Top Layer w0.254: U1.12 92.89,51.23 82.14,40.47 82.14,34.69 83.32,33.51 KEY5.1
KEY6: length 58.6
  Top Layer w0.254: v1(81.55,37.21) 64.78,20.43 KEY6.1 ; U1.13 93.29,48.8 v1(82.72,38.23)
  Bottom Layer w0.254: v1(81.55,37.21) 81.71,37.21 v1(82.72,38.23)
KEY7: length 49.9
  Top Layer w0.254: KEY7.1 101.86,53.5 U1.14
KEY8: length 32.5
  Top Layer w0.254: v1(95.17,61.01) 95.17,61.83 U1.15 ; KEY8.1 95.24,47.1 v1(95.24,59.29)
  Bottom Layer w0.254: v1(95.17,61.01) 95.17,59.36 v1(95.24,59.3)
LC: length 113.4
  Top Layer w0.254: LEFTCLICK.1 4.32,71.56 27.08,48.81 37.1,48.81 arc(38.45,49.93) 39.81,48.81 43.32,48.81 43.57,48.55 arc(44.95,47.17) 46.33,48.55 46.59,48.81 89.07,48.81 91.29,51.02 91.29,57.93 90.15,59.08 90.15,60.22 90.09,60.27 U1.5
LED1: length 42.9
  Top Layer w0.254: U1.18 94.5,63.71 93.98,63.71 93.93,63.75 v1(93.34,63.75) ; R1.1 54.77,63.8 55.45,64.49 63.5,64.49 64.6,63.39 65.7,63.39 66.12,63.8 75.49,63.8 v1(75.82,64.13)
  Bottom Layer w0.254: v1(93.34,63.75) 92.96,64.13 78.04,64.13 77.76,63.85 77.27,63.85 76.99,64.13 v1(75.82,64.13)
LED2: length 44.8
  Top Layer w0.254: v1(79.12,69.98) 78.49,69.34 76.58,69.34 76.42,69.18 76.42,68.69 75.16,67.43 72.5,67.43 71.81,68.11 55.45,68.11 54.77,67.43 R2.1 ; U1.27 94.5,67.27 93.87,67.27 93.55,66.94 v1(92.98,66.94)
  Bottom Layer w0.254: v1(92.98,66.94) 91.38,68.55 88.07,68.55 87.12,69.5 80.05,69.5 79.56,69.98 v1(79.12,69.98)
LED3: length 44.6
  Top Layer w0.254: v1(79.88,70.48) 79.42,70.95 72.45,70.95 71.93,70.44 58.37,70.44 57.57,71.24 57.57,71.28 57.22,71.64 55.45,71.64 54.77,70.95 53.05,70.95 ; U1.28 94.5,67.67 93.98,67.67 93.94,67.63 v1(93.39,67.63)
  Bottom Layer w0.254: v1(93.39,67.63) 92.09,68.93 91.85,68.93 90.05,70.73 88.83,70.73 87.95,69.85 82.37,69.85 81.74,70.48 v1(79.88,70.48)
LED4: length 45
  Top Layer w0.254: v1(83.44,72.77) 84.01,72.77 85.02,73.78 88.43,73.78 90.58,71.62 91.31,71.62 93.67,69.26 93.67,68.54 U1.29 ; v1(73.53,72.93) 71.99,72.93 71.93,72.99 66.31,72.99 65.7,72.39 60.04,72.39 59.29,73.13 55.44,73.13 55.25,72.93 54.59,72.93 R4.1
  Bottom Layer w0.254: v1(83.44,72.77) 83.28,72.93 v1(73.53,72.93)
QSPI0: length 13
  Top Layer w0.254: U1.53 84.32,63.69 80.97,67.04 80.97,69.15 81.31,69.5 81.81,69.5 82.15,69.15 82.15,68.77 U4.5
QSPI1: length 9.5
  Top Layer w0.254: U1.55 87.65,62.87 87.13,62.87 83.88,59.63 81.32,59.63 80.9,60.05 80.9,60.44 80.31,61.03
QSPI2: length 7.3
  Top Layer w0.254: U1.54 83.43,63.29 82.24,62.09 82.24,62.07 82.17,62 82.17,61.62 81.58,61.03
QSPI3: length 11.8
  Top Layer w0.254: U1.51 86.42,64.49 83.42,67.49 83.42,69.15 83.08,69.5 82.31,69.5 81.95,69.86 81.17,69.86 80.61,69.3 80.61,68.42 U4.7
RC: length 78.2
  Top Layer w0.254: v1(90.31,62.67) 90.31,62.35 arc(90.43,62.24) 90.47,62.09 90.47,61.69 U1.6
  Bottom Layer w0.254: v1(90.31,62.67) 69.67,62.67 67.16,60.16 44.88,60.16 31.51,73.53 RIGHTCLICK.1
RESET: length 7.3
  Top Layer w0.254: v1(93.63,66.09) 93.81,66.26 93.81,66.71 93.98,66.87 94.42,66.87 94.44,66.89 U1.26 ; v1(94.74,69.6) 94.75,69.6 RESET.3
  Bottom Layer w0.254: v1(94.74,69.6) 94.74,67.19 v1(93.63,66.09)
VREG: length 5.7
  Top Layer w0.254: C9.1 85.73,70.24 85.73,67.33 86.17,66.89 U1.45
X-PIN: length 54.7
  Top Layer w0.254: U1.38 90.11,68.49 90.11,67.97 90.78,67.31 v1(90.81,67.31)
  Bottom Layer w0.254: v1(90.81,67.31) 89.92,68.19 88.36,68.19 87.75,67.58 72.34,67.58 71.22,68.71 41.24,68.71 40.06,67.53 SW1.6
XIN: length 7.6
  Top Layer w0.254: 99.39,61.18 99.39,63.28 ; U1.20 98.25,64.49 99.43,63.31 X1.1
XOUT: length 5.3
  Top Layer w0.254: 97.58,67.42 97.58,65.54 97.61,65.51 96.99,64.89 U1.21
Y-PIN: length 45
  Top Layer w0.254: U1.39 89.69,67.34 v1(89.66,67.31)
  Bottom Layer w0.254: SW1.3 56.05,66.93 57.31,66.93 58.37,67.99 68.31,67.99 70.87,65.44 71.93,65.44 73.41,66.92 89.27,66.92 v1(89.66,67.31)
$1N5: length 15.6
  Top Layer w0.254: U1.47 85.96,66.09 85.02,67.04 85.02,69.17 81.08,73.11 80.72,73.11 80.18,73.65 80.18,75.92 arc(80.09,76.02) 80.05,76.15 80.05,77.15 USB1.3
$1N6: length 14.9
  Top Layer w0.254: 87.86,66.51 86.05,66.51 85.37,67.18 85.37,69.31 81.22,73.46 80.87,73.46 80.53,73.8 80.53,77.15
$1N65: length 14.7
  Top Layer w0.254: U1.24 95.4,66.09 95.64,66.32 95.64,66.74 95.85,66.96 95.85,67.47 96.73,68.35 98.34,68.35 100.36,66.33 100.36,65.65 104.13,61.88 SWCLK.1
$1N66: length 13.5
  Top Layer w0.254: SWDIO.1 101.15,69.63 98.27,69.63 98.15,69.75 96.23,69.75 95.25,68.77 95.25,66.7 95.06,66.51 94.54,66.51 U1.25
$1N128: length 5.4
  Top Layer w0.254: TX.1 88.89,57.05 88.89,59.62 89.01,59.73 89.01,60.5 88.89,60.62 U1.2
$1N129: length 11.6
  Top Layer w0.254: U1.3 89.29,60.72 89.36,60.65 89.36,59.58 89.25,59.47 89.25,58.56 arc(90.21,57.75) 90.58,56.55 arc(90.23,55.36) 89.29,54.56 89.29,52.52 88.39,51.62
$1N131: length 2.9
  Top Layer w0.254: R1.2 55.96,65.31 LED1.2
$1N132: length 2.9
  Top Layer w0.254: R2.2 55.96,68.93 LED2.2
$1N134: length 2.9
  Top Layer w0.254: LED3.2 55.96,72.46 R3.2
$1N136: length 2.9
  Top Layer w0.254: R4.2 55.96,75.98 LED4.2

## Copper pours and planes (outline as drawn; the poured copper is in the pictures)
GND on GND: 0.26,81.66 117.22,81.66 117.22,0.26 0.26,0.26
VCC on VCC: 0.26,81.66 117.22,81.66 117.22,0.26 0.26,0.26

Small or netless copper shapes (teardrops, artwork), in the pictures only: 8 on VCC, 72 on GND
